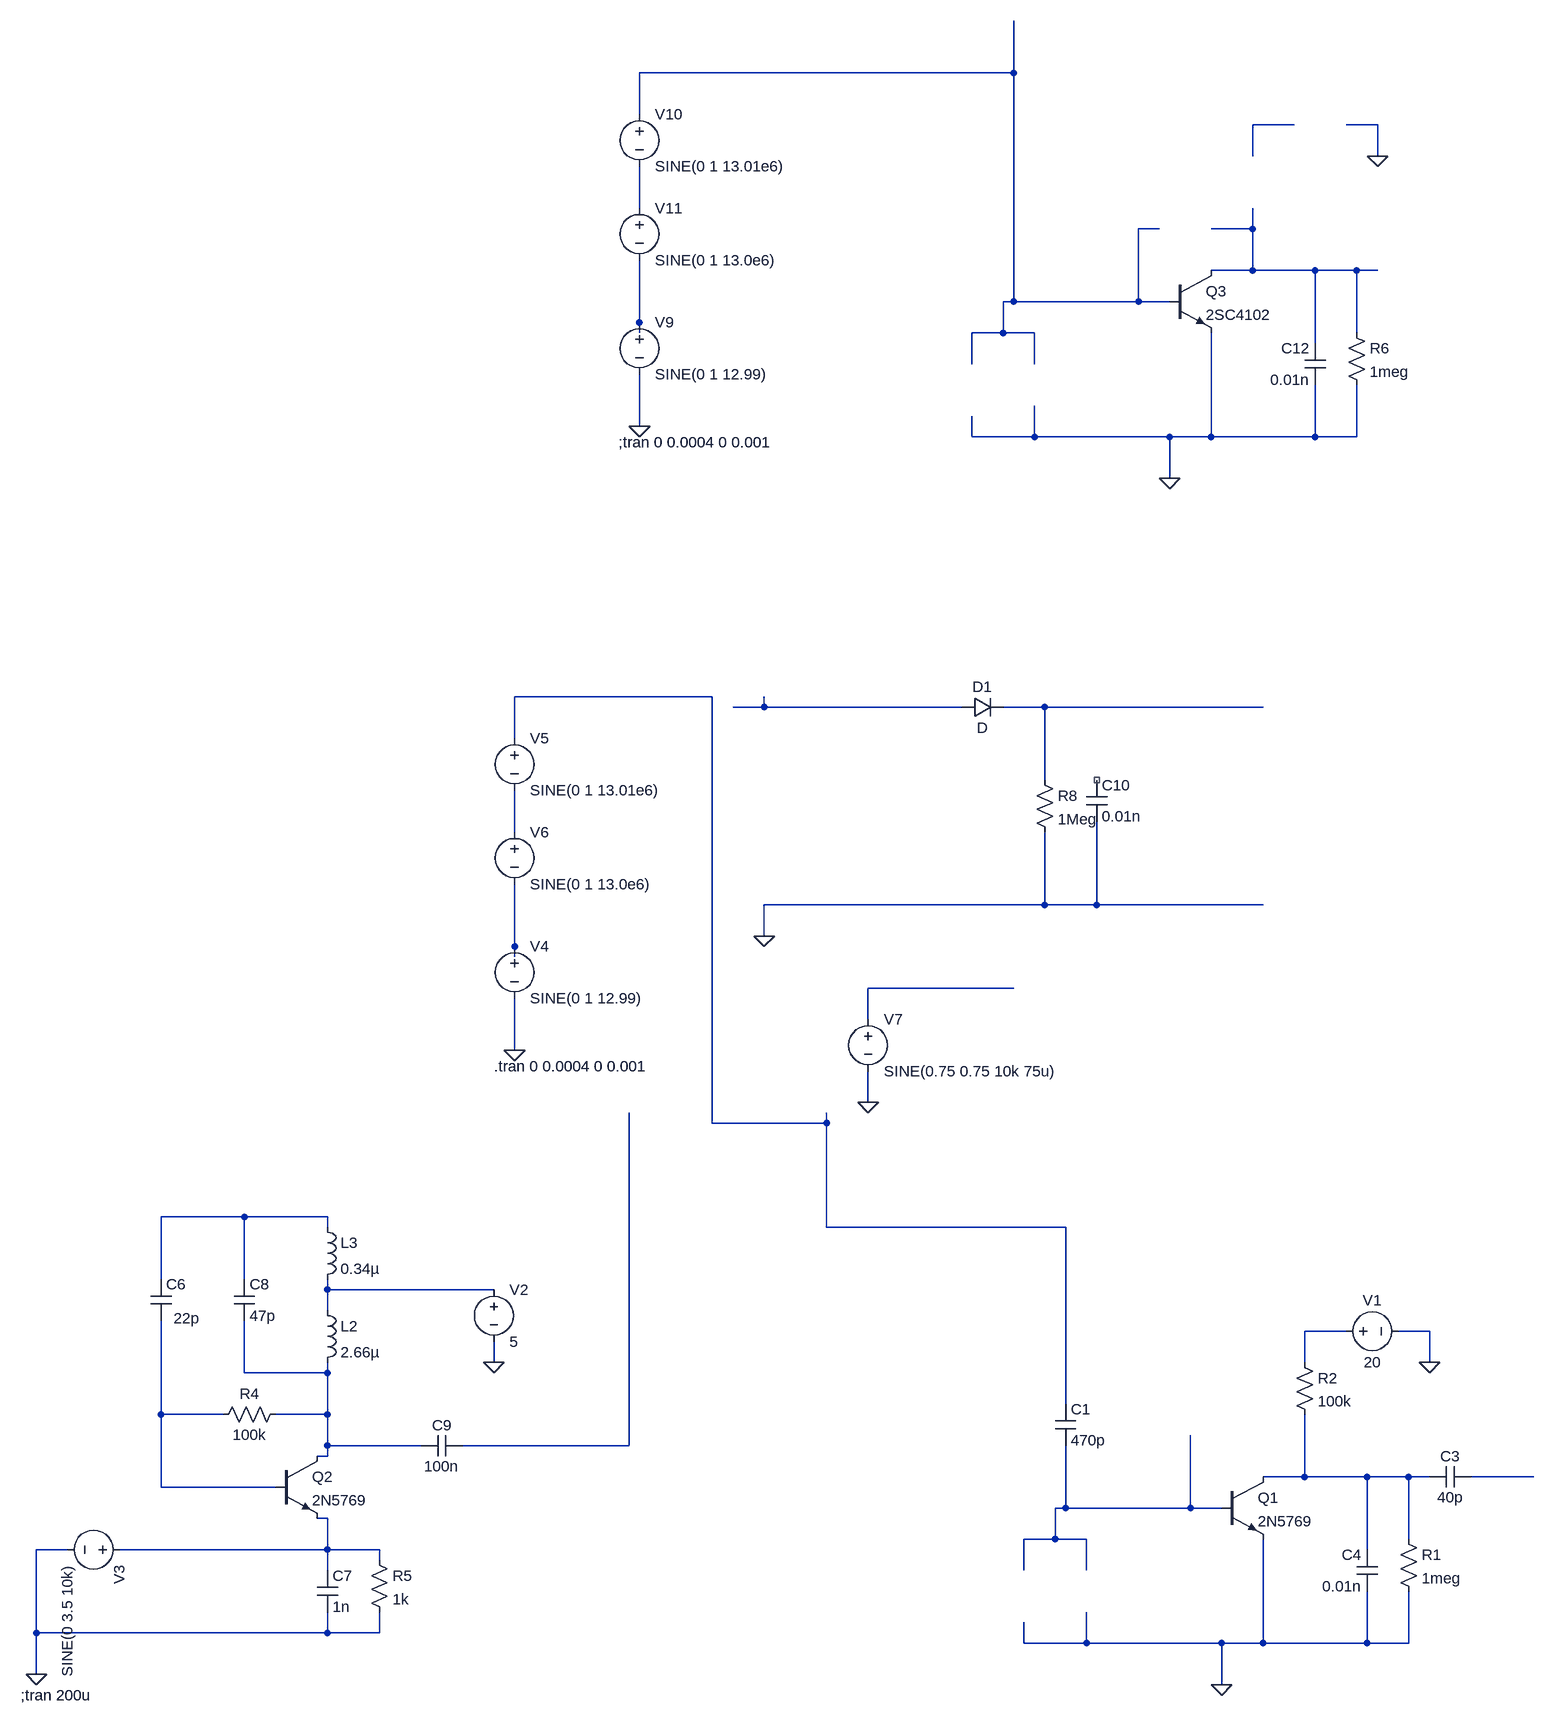
[diagram p0: schematic EmpfängerRadio2.0.asc]
EmpfängerRadio2.0.asc, the LTspice schematic file:
Version 4
SHEET 1 1508 680
WIRE 704 -2000 704 -2080
WIRE 704 -2000 128 -2000
WIRE 128 -1936 128 -2000
WIRE 1136 -1920 1072 -1920
WIRE 1264 -1920 1216 -1920
WIRE 1072 -1872 1072 -1920
WIRE 1264 -1872 1264 -1920
WIRE 128 -1792 128 -1856
WIRE 928 -1760 896 -1760
WIRE 1072 -1760 1072 -1792
WIRE 1072 -1760 1008 -1760
WIRE 1072 -1696 1072 -1760
WIRE 1072 -1696 1008 -1696
WIRE 1168 -1696 1072 -1696
WIRE 1232 -1696 1168 -1696
WIRE 1264 -1696 1232 -1696
WIRE 704 -1648 704 -2000
WIRE 704 -1648 688 -1648
WIRE 896 -1648 896 -1760
WIRE 896 -1648 704 -1648
WIRE 944 -1648 896 -1648
WIRE 128 -1616 128 -1712
WIRE 128 -1600 128 -1616
WIRE 688 -1600 688 -1648
WIRE 688 -1600 640 -1600
WIRE 736 -1600 688 -1600
WIRE 1232 -1600 1232 -1696
WIRE 1168 -1584 1168 -1696
WIRE 640 -1552 640 -1600
WIRE 736 -1552 736 -1600
WIRE 128 -1456 128 -1536
WIRE 640 -1440 640 -1472
WIRE 736 -1440 736 -1488
WIRE 736 -1440 640 -1440
WIRE 944 -1440 736 -1440
WIRE 1008 -1440 1008 -1600
WIRE 1008 -1440 944 -1440
WIRE 1168 -1440 1168 -1520
WIRE 1168 -1440 1008 -1440
WIRE 1232 -1440 1232 -1520
WIRE 1232 -1440 1168 -1440
WIRE 944 -1376 944 -1440
WIRE 240 -1040 -64 -1040
WIRE 320 -1024 320 -1040
WIRE 320 -1024 272 -1024
WIRE 624 -1024 320 -1024
WIRE 752 -1024 688 -1024
WIRE 1088 -1024 752 -1024
WIRE -64 -976 -64 -1040
WIRE 752 -912 752 -1024
WIRE -64 -832 -64 -896
WIRE 752 -720 752 -832
WIRE 752 -720 320 -720
WIRE 832 -720 832 -848
WIRE 832 -720 752 -720
WIRE 1088 -720 832 -720
WIRE 320 -672 320 -720
WIRE -64 -656 -64 -752
WIRE -64 -640 -64 -656
WIRE 704 -592 480 -592
WIRE 480 -544 480 -592
WIRE -64 -496 -64 -576
WIRE 480 -416 480 -464
WIRE 240 -384 240 -1040
WIRE 416 -384 416 -400
WIRE 416 -384 240 -384
WIRE -480 -240 -608 -240
WIRE -352 -240 -480 -240
WIRE -352 -224 -352 -240
WIRE 416 -224 416 -384
WIRE 784 -224 416 -224
WIRE -608 -144 -608 -240
WIRE -480 -144 -480 -240
WIRE -352 -128 -352 -144
WIRE -96 -128 -352 -128
WIRE -352 -96 -352 -128
WIRE 1216 -64 1152 -64
WIRE 1344 -64 1296 -64
WIRE -96 -16 -96 -48
WIRE 1152 -16 1152 -64
WIRE 1344 -16 1344 -64
WIRE -480 0 -480 -80
WIRE -352 0 -352 -16
WIRE -352 0 -480 0
WIRE 784 48 784 -224
WIRE -608 64 -608 -80
WIRE -512 64 -608 64
WIRE -352 64 -352 0
WIRE -352 64 -432 64
WIRE -352 112 -352 64
WIRE -208 112 -352 112
WIRE 112 112 112 -400
WIRE 112 112 -144 112
WIRE -352 128 -352 112
WIRE -352 128 -368 128
WIRE 1152 160 1152 64
WIRE 1152 160 1088 160
WIRE 1248 160 1152 160
WIRE 1312 160 1248 160
WIRE 1344 160 1312 160
WIRE 1504 160 1408 160
WIRE -608 176 -608 64
WIRE -432 176 -608 176
WIRE 784 208 784 112
WIRE 784 208 768 208
WIRE 976 208 976 96
WIRE 976 208 784 208
WIRE 1024 208 976 208
WIRE -352 224 -368 224
WIRE 768 256 768 208
WIRE 768 256 720 256
WIRE 816 256 768 256
WIRE 1312 256 1312 160
WIRE -752 272 -800 272
WIRE -352 272 -352 224
WIRE -352 272 -672 272
WIRE -272 272 -352 272
WIRE 1248 272 1248 160
WIRE -272 288 -272 272
WIRE -352 304 -352 272
WIRE 720 304 720 256
WIRE 816 304 816 256
WIRE -800 400 -800 272
WIRE -352 400 -352 368
WIRE -352 400 -800 400
WIRE -272 400 -272 368
WIRE -272 400 -352 400
WIRE 720 416 720 384
WIRE 816 416 816 368
WIRE 816 416 720 416
WIRE 1024 416 816 416
WIRE 1088 416 1088 256
WIRE 1088 416 1024 416
WIRE 1248 416 1248 336
WIRE 1248 416 1088 416
WIRE 1312 416 1312 336
WIRE 1312 416 1248 416
WIRE -800 464 -800 400
WIRE 1024 480 1024 416
FLAG 1024 480 0
FLAG 1344 -16 0
FLAG -800 464 0
FLAG -96 -16 0
FLAG -64 -496 0
FLAG 320 -672 0
FLAG 480 -416 0
FLAG 944 -1376 0
FLAG 1264 -1872 0
FLAG 128 -1456 0
SYMBOL cap 1408 144 R90
WINDOW 0 0 32 VBottom 2
WINDOW 3 32 32 VTop 2
SYMATTR InstName C3
SYMATTR Value 40p
SYMBOL cap 1264 336 R180
WINDOW 0 24 56 Left 2
WINDOW 3 24 8 Left 2
SYMATTR InstName C4
SYMATTR Value 0.01n
SYMBOL res 1296 240 R0
SYMATTR InstName R1
SYMATTR Value 1meg
SYMBOL res 1136 -32 R0
SYMATTR InstName R2
SYMATTR Value 100k
SYMBOL npn 1024 160 R0
SYMATTR InstName Q1
SYMATTR Value 2N5769
SYMBOL voltage 1200 -64 R270
WINDOW 0 32 56 VTop 2
WINDOW 3 -32 56 VBottom 2
WINDOW 123 0 0 Left 2
WINDOW 39 0 0 Left 2
SYMATTR InstName V1
SYMATTR Value 20
SYMBOL res -416 48 R90
WINDOW 0 0 56 VBottom 2
WINDOW 3 32 56 VTop 2
SYMATTR InstName R4
SYMATTR Value 100k
SYMBOL res -288 272 R0
SYMATTR InstName R5
SYMATTR Value 1k
SYMBOL cap -624 -144 R0
WINDOW 3 35 60 Left 2
SYMATTR Value 22p
SYMATTR InstName C6
SYMBOL cap -368 304 R0
SYMATTR InstName C7
SYMATTR Value 1n
SYMBOL cap -496 -144 R0
SYMATTR InstName C8
SYMATTR Value 47p
SYMBOL cap -144 96 R90
WINDOW 0 0 32 VBottom 2
WINDOW 3 32 32 VTop 2
SYMATTR InstName C9
SYMATTR Value 100n
SYMBOL ind -368 -112 R0
SYMATTR InstName L2
SYMATTR Value 2.66µ
SYMBOL ind -368 -240 R0
SYMATTR InstName L3
SYMATTR Value 0.34µ
SYMBOL npn -432 128 R0
SYMATTR InstName Q2
SYMATTR Value 2N5769
SYMBOL voltage -96 -144 R0
WINDOW 123 0 0 Left 2
WINDOW 39 0 0 Left 2
SYMATTR InstName V2
SYMATTR Value 5
SYMBOL voltage -656 272 R90
WINDOW 123 0 0 Left 2
WINDOW 39 0 0 Left 2
SYMATTR InstName V3
SYMATTR Value SINE(0 3.5 10k)
SYMBOL voltage -64 -672 R0
WINDOW 123 0 0 Left 2
WINDOW 39 0 0 Left 2
SYMATTR InstName V4
SYMATTR Value SINE(0 1 12.99)
SYMBOL voltage -64 -992 R0
WINDOW 123 0 0 Left 2
WINDOW 39 0 0 Left 2
SYMATTR InstName V5
SYMATTR Value SINE(0 1 13.01e6)
SYMBOL voltage -64 -848 R0
WINDOW 123 0 0 Left 2
WINDOW 39 0 0 Left 2
SYMATTR InstName V6
SYMATTR Value SINE(0 1 13.0e6)
SYMBOL diode 624 -1008 R270
WINDOW 0 32 32 VTop 2
WINDOW 3 0 32 VBottom 2
SYMATTR InstName D1
SYMBOL res 736 -928 R0
SYMATTR InstName R8
SYMATTR Value 1Meg
SYMBOL voltage 480 -560 R0
WINDOW 123 0 0 Left 2
WINDOW 39 0 0 Left 2
SYMATTR InstName V7
SYMATTR Value SINE(0.75 0.75 10k 75u)
SYMBOL cap 816 -912 R0
SYMATTR InstName C10
SYMATTR Value 0.01n
SYMBOL cap 1184 -1520 R180
WINDOW 0 24 56 Left 2
WINDOW 3 24 8 Left 2
SYMATTR InstName C12
SYMATTR Value 0.01n
SYMBOL res 1216 -1616 R0
SYMATTR InstName R6
SYMATTR Value 1meg
SYMBOL npn 944 -1696 R0
SYMATTR InstName Q3
SYMATTR Value 2SC4102
SYMBOL voltage 128 -1632 R0
WINDOW 123 0 0 Left 2
WINDOW 39 0 0 Left 2
SYMATTR InstName V9
SYMATTR Value SINE(0 1 12.99)
SYMBOL voltage 128 -1952 R0
WINDOW 123 0 0 Left 2
WINDOW 39 0 0 Left 2
SYMATTR InstName V10
SYMATTR Value SINE(0 1 13.01e6)
SYMBOL voltage 128 -1808 R0
WINDOW 123 0 0 Left 2
WINDOW 39 0 0 Left 2
SYMATTR InstName V11
SYMATTR Value SINE(0 1 13.0e6)
SYMBOL cap 768 48 R0
SYMATTR InstName C1
SYMATTR Value 470p
TEXT -824 496 Left 2 !;tran 200u
TEXT -96 -472 Left 2 !.tran 0 0.0004 0 0.001
TEXT 96 -1432 Left 2 !;tran 0 0.0004 0 0.001

The netlist it stands for:
* EmpfängerRadio2.0.asc
C3 N019 N018 40p
C4 0 N018 0.01n
R1 N018 0 1meg
R2 N014 N018 100k
Q1 N018 N020 0 0 2N5769
V1 N014 0 20
R4 N015 N016 100k
R5 N021 0 1k
C6 N012 N016 22p
C7 N021 0 1n
C8 N012 N015 47p
C9 N017 N015 100n
L2 N013 N015 2.66µ
L3 N012 N013 0.34µ
Q2 N015 N016 N021 0 2N5769
V2 N013 0 5
V3 N021 0 SINE(0 3.5 10k)
V4 N010 0 SINE(0 1 12.99)
V5 N006 N009 SINE(0 1 13.01e6)
V6 N009 N010 SINE(0 1 13.0e6)
D1 N007 N008 D
R8 N008 0 1Meg
V7 N011 0 SINE(0.75 0.75 10k 75u)
C10 NC_01 0 0.01n
C12 0 N004 0.01n
R6 N004 0 1meg
Q3 N004 N001 0 0 2SC4102
V9 N005 0 SINE(0 1 12.99)
V10 N001 N003 SINE(0 1 13.01e6)
V11 N003 N005 SINE(0 1 13.0e6)
C1 N006 N020 470p
.model D D
.lib standard.dio
.model NPN NPN
.model PNP PNP
.lib standard.bjt
;tran 200u
.tran 0 0.0004 0 0.001
;tran 0 0.0004 0 0.001
.backanno
.end